# Altium schematic sheet low-pass-filter.SchDoc
size A4
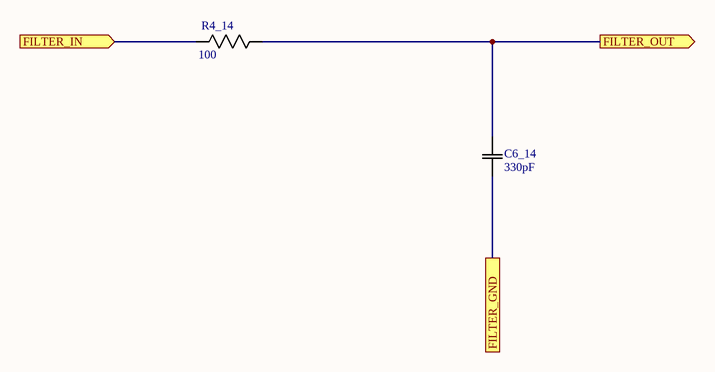
[diagram p0: low-pass-filter.SchDoc]

## Parts
C6_14  330pF  [0805]
R4_14  100  [0805]

## Ports
FILTER_GND, FILTER_IN (in), FILTER_OUT (out)

## Nets
FILTER_GND: C6_14.1(C1) ; port FILTER_GND
FILTER_IN: R4_14.2(R2) ; port FILTER_IN
FILTER_OUT: C6_14.2(C2) R4_14.1(R1) ; port FILTER_OUT

## Library data of the parts
C6_14 = CAP 330pF 16V: CAP CER 330PF 16V X5R 0603/0805; Tolerance: 10%; Part Number: CAP 330pF 16V; Value: 330pF; Rating: 16V; Temperature Coefficient: X5R; Package: 0603/0805; Operating Temperature: -55°C ~ 85°C
R4_14 = RES 100.0 1/8W 5%: RES SMD 100 OHM 5% 1/8W 0805; Manufacturer Part Number 1: RK73B1JRTTD101J; Power (Watts): 0.125W; Package: 0805; Value: 100; Tolerance: 5%; Part Number: RES 100.0 1/8W 5%; Supplier 1: Digi-Key; Supplier Part Number 1: 2019-RK73B1JRTTD101JCT-ND; Supplier URL 1: https://www.digikey.ca/en/products/detail/koa-speer-electronics-inc/RK73B1JRTTD101J/12156165?s=N4IgTCBcDaIEoGkDsBmAQgRgFJwCq4BEMAGbAYVxAF0BfIA; Manufacturer Part Number 2: RMCF0805JT100R; Supplier 2: Digi-Key; Supplier Part Number 2: RMCF0805JT100RCT-ND; Supplier URL 2: https://www.digikey.ca/en/products/detail/stackpole-electronics-inc/RMCF0805JT100R/1757756?s=N4IgTCBcDaIEoFkDCAxADADjQVgFIBUBGNNOJfEAXQF8g; Tolerance 2: 5%